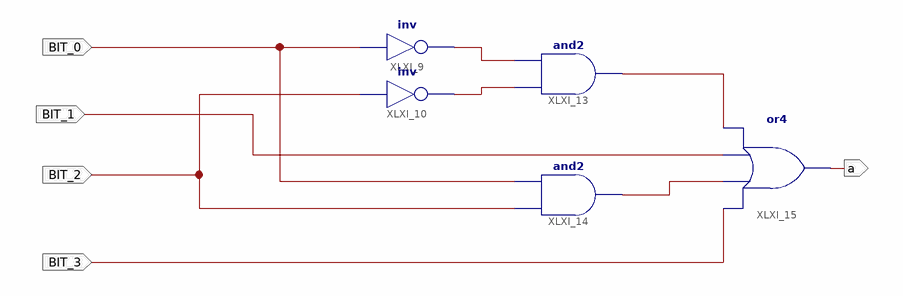
[diagram p0: schematic sheet 1]
// Xilinx ISE schematic SEG_A.sch (spartan6) as structural Verilog: 5 symbols, 5 ports
module SEG_A (
  input  BIT_0,
  input  BIT_1,
  input  BIT_2,
  input  BIT_3,
  output a
);

  wire XLXN_24, XLXN_25, XLXN_26, XLXN_27;

  not XLXI_9 (XLXN_25, BIT_0);
  not XLXI_10 (XLXN_26, BIT_2);
  and XLXI_13 (XLXN_24, XLXN_26, XLXN_25);
  and XLXI_14 (XLXN_27, BIT_2, BIT_0);
  or XLXI_15 (a, BIT_3, XLXN_27, BIT_1, XLXN_24);
endmodule
